# Altium schematic sheet INSGPS.SchDoc
size Legal
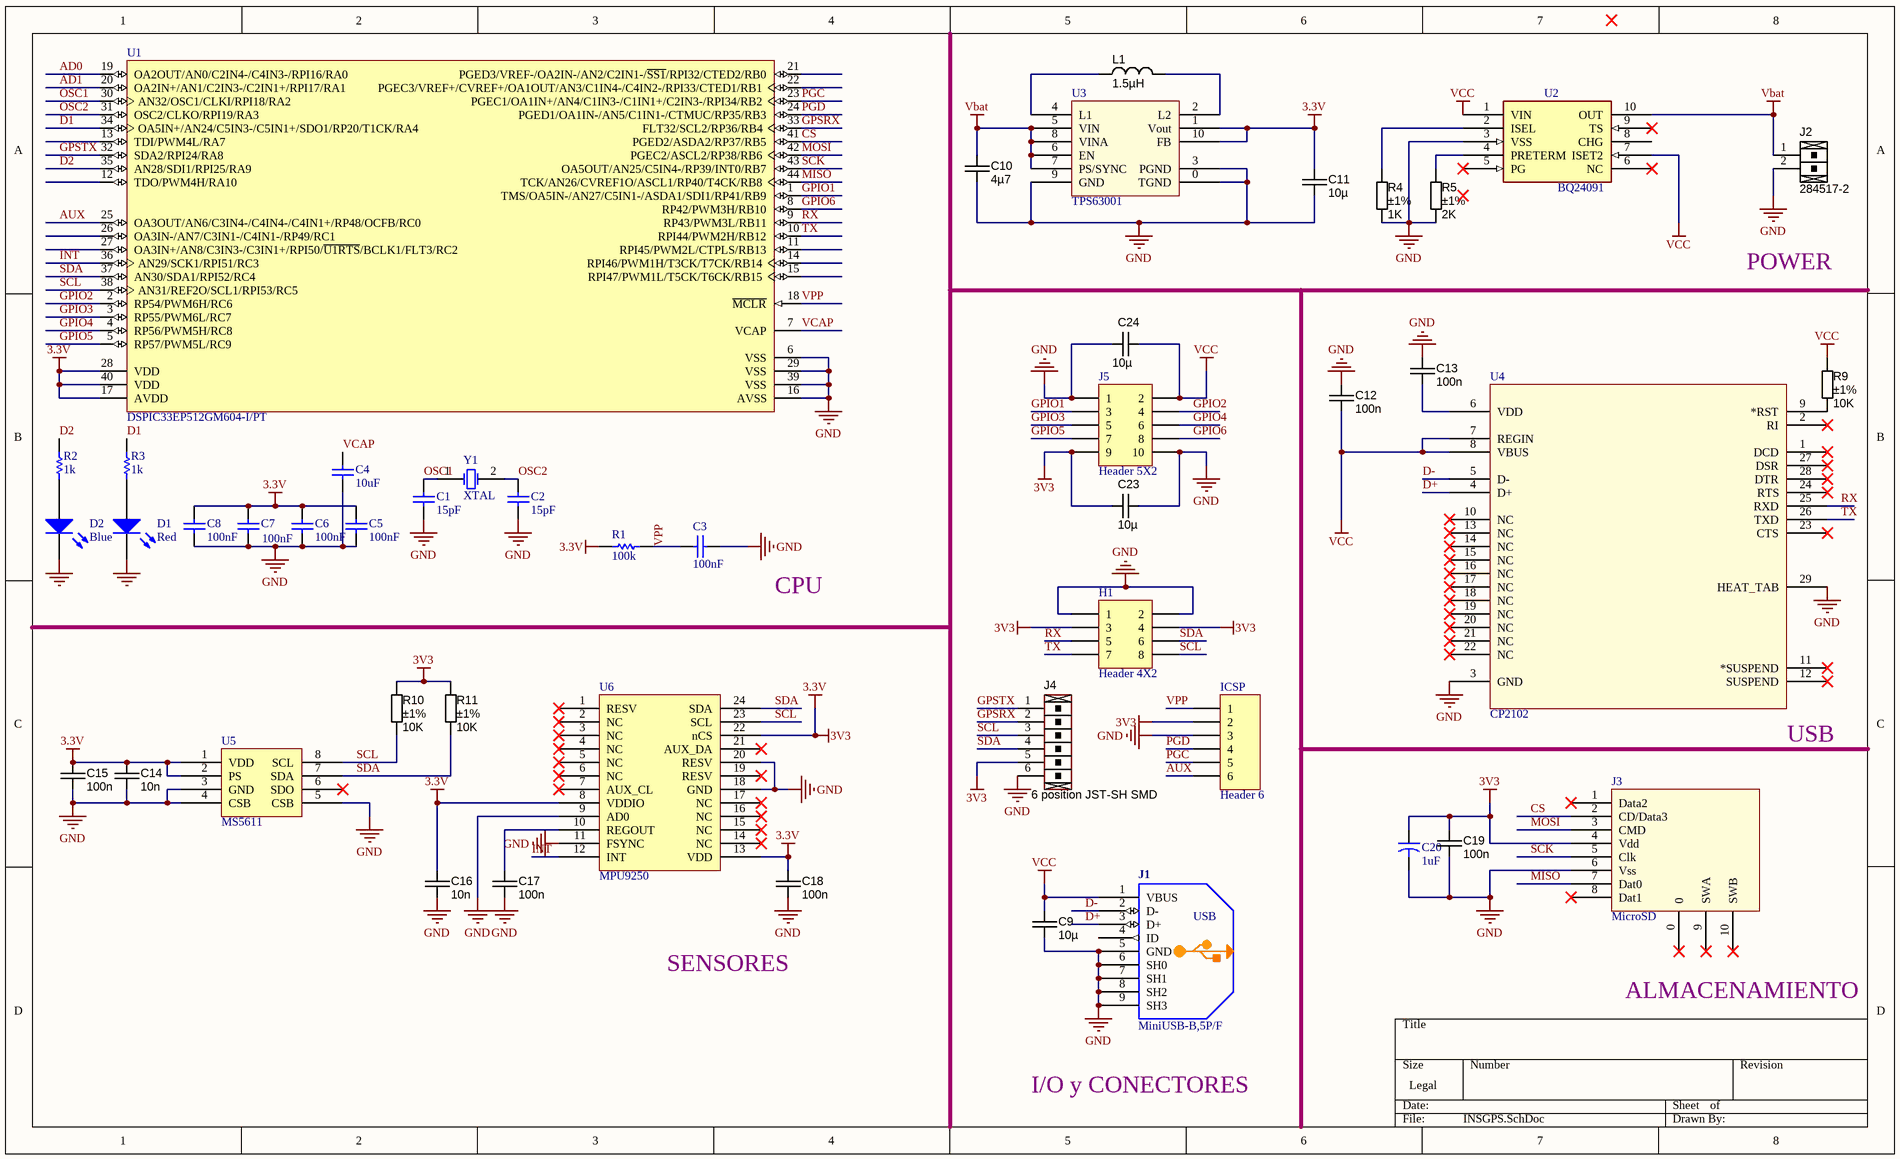
[diagram p0: INSGPS.SchDoc]

## Parts
C1  15pF  [C0805]
C2  15pF  [C0805]
C3  100nF  [C0805]
C4  10uF  [C0805]
C5  100nF  [C0805]
C6  100nF  [C0805]
C7  100nF  [C0805]
C8  100nF  [C0805]
C9  10µ  [CAPC3216X180N]
C10  4µ7  [CAPC2012X135N]
C11  10µ  [CAPC3216X180N]
C12  100n  [CAPC2012X135N]
C13  100n  [CAPC2012X135N]
C14  10n  [CAPC2012X135N]
C15  100n  [CAPC2012X135N]
C16  10n  [CAPC2012X135N]
C17  100n  [CAPC2012X135N]
C18  100n  [CAPC2012X135N]
C19  100n  [CAPC2012X135N]
C20  1uF  [CC3216-1206]
C23  10µ  [CAPC3216X180N]
C24  10µ  [CAPC3216X180N]
D1  Red  [0805 LED RED]
D2  Blue  [0805 LED RED]
H1  Header 4X2  [HDR2X4]
ICSP  Header 6  [HDR1X6]
J1  value MiniUSB-B,5P/F  [USB_MINIB_SMT]  (hidden comment: USB_MINIB_SMT)
J2  Manufacturer Part Number 1: 284517-2  [S2B-PH-K-S]  (hidden comment: ST 2 pins 1mm pitch)
J3  MicroSD  [SD CARD]
J4  6 position JST-SH SMD  [SM06B-SRSS-TB]
J5  Header 5X2  [HDR2X5]
L1  1.5µH  [IND_COILCRAFT_LPS3015]
R1  100k  [6-0805_M]
R2  1k  [6-0805_M]
R3  1k  [6-0805_M]
R4  Tolerance: ±1%  [RESC2012X70N]  (hidden comment: 1K)
R5  Tolerance: ±1%  [RESC2012X70N]  (hidden comment: 2K)
R9  Tolerance: ±1%  [RESC2012X70N]  (hidden comment: 10K)
R10  Tolerance: ±1%  [RESC2012X70N]  (hidden comment: 10K)
R11  Tolerance: ±1%  [RESC2012X70N]  (hidden comment: 10K)
U1  DSPIC33EP512GM604-I/PT  [TQFP-44]
U2  BQ24091  [10MSOP-PowerPAD]
U3  TPS63001  [TDFN-EP 10]
U4  CP2102  [QFN50P400X400X95-28N]
U5  MS5611  [MS5611]
U6  MPU9250  [QFN50P400X400X95-24N]
Y1  XTAL  [CRYSTAL_NX5032GA / NX5032GB]

## Nets
3.3V: C5.2 C6.1 C7.2 C8.2 C11.1 C14.1 C15.1 C16.1 C18.1 C19.1 C20.1 C23.1 H1.3 H1.4 ICSP.2 J3.4(Vdd) J4.5 J5.9 R1.2 R10.1 R11.1 U1.17(AVDD) U1.28(VDD) U1.40(VDD) U3.1(Vout) U3.10(FB) U5.1(VDD) U5.2(PS) U6.8(VDDIO) U6.13(VDD) U6.22(nCS)  [also labelled 3V3]
GND: C1.1 C2.1 C3.1 C4.1 C5.1 C6.2 C7.1 C8.1 C9.2 C10.2 C11.2 C12.2 C13.1 C14.2 C15.2 C16.2 C17.2 C18.2 C19.2 C20.2 C23.2 C24.1 D1.2(K) D2.2(K) H1.1 H1.2 ICSP.3 J1.5(GND) J1.6(SH0) J1.7(SH1) J1.8(SH2) J1.9(SH3) J2.2 J3.6(Vss) J4.6 J5.1 J5.10 R4.2 R5.2 U1.6(VSS) U1.16(AVSS) U1.29(VSS) U1.39(VSS) U2.3(VSS) U3.0(TGND) U3.3(PGND) U3.9(GND) U4.3(GND) U4.29(HEAT_TAB) U5.3(GND) U5.4(CSB) U5.5(CSB) U6.9(AD0) U6.11(FSYNC) U6.18(GND) U6.20(RESV)
Vbat: C10.1 J2.1 U2.10(OUT) U3.5(VIN) U3.6(EN) U3.7(PS/SYNC) U3.8(VINA)
VCC: C9.1 C12.1 C24.2 J1.1(VBUS) J5.2 R9.1 U2.1(VIN) U2.7(ISET2) U4.7(REGIN) U4.8(VBUS)
AD0: U1.19(OA2OUT/AN0/C2IN4-/C4IN3-/RPI16/RA0)
AD1: U1.20(OA2IN+/AN1/C2IN3-/C2IN1+/RPI17/RA1)
AUX: ICSP.6 U1.25(OA3OUT/AN6/C3IN4-/C4IN4-/C4IN1+/RP48/OCFB/RC0)
CS: J3.2(CD/Data3) U1.41(PGED2/ASDA2/RP37/RB5)
D1: R3.1 U1.34(OA5IN+/AN24/C5IN3-/C5IN1+/SDO1/RP20/T1CK/RA4)
D2: R2.1 U1.35(AN28/SDI1/RPI25/RA9)
D+: J1.3(D+) U4.4(D+)
D-: J1.2(D-) U4.5(D-)
GPIO1: J5.3 U1.1(TMS/OA5IN-/AN27/C5IN1-/ASDA1/SDI1/RP41/RB9)
GPIO2: J5.4 U1.2(RP54/PWM6H/RC6)
GPIO3: J5.5 U1.3(RP55/PWM6L/RC7)
GPIO4: J5.6 U1.4(RP56/PWM5H/RC8)
GPIO5: J5.7 U1.5(RP57/PWM5L/RC9)
GPIO6: J5.8 U1.8(RP42/PWM3H/RB10)
GPSRX: J4.2 U1.33(FLT32/SCL2/RP36/RB4)
GPSTX: J4.1 U1.32(SDA2/RPI24/RA8)
INT: U1.36(AN29/SCK1/RPI51/RC3) U6.12(INT)
MISO: J3.7(Dat0) U1.44(TCK/AN26/CVREF1O/ASCL1/RP40/T4CK/RB8)
MOSI: J3.3(CMD) U1.42(PGEC2/ASCL2/RP38/RB6)
OSC1: C1.2 U1.30(AN32/OSC1/CLKI/RPI18/RA2) Y1.1(OSC1)
OSC2: C2.2 U1.31(OSC2/CLKO/RPI19/RA3) Y1.2(OSC2)
PGC: ICSP.5 U1.23(PGEC1/OA1IN+/AN4/C1IN3-/C1IN1+/C2IN3-/RPI34/RB2)
PGD: ICSP.4 U1.24(PGED1/OA1IN-/AN5/C1IN1-/CTMUC/RP35/RB3)
RX: H1.5 U1.9(RP43/PWM3L/RB11) U4.25(RXD)
SCK: J3.5(Clk) U1.43(OA5OUT/AN25/C5IN4-/RP39/INT0/RB7)
SCL: H1.8 J4.3 R10.2 U1.38(AN31/REF2O/SCL1/RPI53/RC5) U5.8(SCL) U6.23(SCL)
SDA: H1.6 J4.4 R11.2 U1.37(AN30/SDA1/RPI52/RC4) U5.7(SDA) U6.24(SDA)
TX: H1.7 U1.10(RPI44/PWM2H/RB12) U4.26(TXD)
VCAP: C4.2 U1.7(VCAP)
VPP: C3.2 ICSP.1 R1.1 U1.18(~{MCLR})
NetC13_2: C13.2 U4.6(VDD)
NetC17_1: C17.1 U6.10(REGOUT)
NetD1_1: D1.1(A) R3.2
NetD2_1: D2.1(A) R2.2
NetL1_1: L1.1 U3.4(L1)
NetL1_2: L1.2 U3.2(L2)
NetR4_1: R4.1 U2.2(ISEL)
NetR5_1: R5.1 U2.4(PRETERM)
NetR9_2: R9.2 U4.9(*RST)

Not connected (* = marked no-connect by the designer): J1 4(ID); J3 0* 1(Data2)* 8(Dat1)* 9(SWA)* 10(SWB)*; U1 11(RPI45/PWM2L/CTPLS/RB13) 12(TDO/PWM4H/RA10) 13(TDI/PWM4L/RA7) 14(RPI46/PWM1H/T3CK/T7CK/RB14) 15(RPI47/PWM1L/T5CK/T6CK/RB15) 21(PGED3/VREF-/OA2IN-/AN2/C2IN1-/~{SS1}/RPI32/CTED2/RB0) 22(PGEC3/VREF+/CVREF+/OA1OUT/AN3/C1IN4-/C4IN2-/RPI33/CTED1/RB1) 26(OA3IN-/AN7/C3IN1-/C4IN1-/RP49/RC1) 27(OA3IN+/AN8/C3IN3-/C3IN1+/RPI50/~{U1RTS}/BCLK1/FLT3/RC2); U2 5(PG)* 6(NC)* 8(CHG) 9(TS)*; U4 1(DCD)* 2(RI)* 10(NC)* 11(*SUSPEND)* 12(SUSPEND)* 13(NC)* 14(NC)* 15(NC)* 16(NC)* 17(NC)* 18(NC)* 19(NC)* 20(NC)* 21(NC)* 22(NC)* 23(CTS)* 24(RTS)* 27(DSR)* 28(DTR)*; U5 6(SDO)*; U6 1(RESV)* 2(NC)* 3(NC)* 4(NC)* 5(NC)* 6(NC)* 7(AUX_CL)* 14(NC)* 15(NC)* 16(NC)* 17(NC)* 19(RESV)* 21(AUX_DA)*

## Notes on the sheet
- POWER
- CPU
- (near U4) USB
- SENSORES
- ALMACENAMIENTO
- I/O y CONECTORES
- (in symbol USB_MINIB_SMT) USB

## Library data of the parts
C1-C8 = Cap: Capacitor; Published: 8-Jun-2000; LatestRevisionDate: 17-Jul-2002; LatestRevisionNote: Re-released for DXP Platform.; PackageReference: RAD-0.3; Publisher: Altium Limited; PackageDescription: Radial Cap, Thru-Hole; 2 Leads; 0.3 in Pin Spacing
  C1 C2: Value: 15pF
  C3 C5-C8: Value: 100nF
  C4: Value: 10uF
C9 C11 C23 C24 = CAPC_10u_1206_10V: Capacitor SMD Cer 10uF 10% 10V X5R 1206; Manufacturer 1: KEMET; Manufacturer Part Number 1: C1206C106K8PACTU; Ratings: 10V; X5R; Material: ceramic; SCDType: undef; Package / Case: 1206 (3216 metric); Tolerance: ±10%; Supplier 1: Digi-Key; Supplier Part Number 1: C1206C106K8PACTU-ND; Value: 10µ
C10 = CAPC_4u7_0805: Capacitor SMD Cer 4.7uF 10% 16V X5R 0805; Manufacturer 1: Taiyo Yuden; Manufacturer Part Number 1: EMK212BJ475KG-T; Ratings: 16V; X5R; Material: ceramic; SCDType: spec; Package / Case: 0805 (2012 Metric); Tolerance: ±10%; Supplier 1: Digi-Key; Supplier Part Number 1: 587-1294-1-ND; Operating Temperature: -55°C ~ 85°C; Size / Dimension: 0.079" L x 0.049" W (2.00mm x 1.25mm); Thickness (Max): 0.053" (1.35mm); ComponentLink1URL: http://www.yuden.co.jp/productdata/catalog/en/mlcc01_e.pdf; ComponentLink1Description: http://www.yuden.co.jp/productdata/catalog/en/mlcc01_e.pdf; Supplier 2: Digi-Key; Supplier Part Number 2: 1276-1065-1-ND; Manufacturer 2: Samsung Electro-Mechanics America, Inc; Manufacturer Part Number 2: CL21A475KOFNNNE; RoHS 2: RoHS Compliant; ComponentLink2URL: http://www.samsungsem.com/servlet/FileDownload?type=spec&file=CL21A475KOFNNNE.pdf; ComponentLink2Description: http://www.samsungsem.com/servlet/FileDownload?type=spec&file=CL21A475KOFNNNE.pdf; Supplier 3: Digi-Key; Supplier Part Number 3: 399-8101-1-ND; Manufacturer 3: Kemet; Manufacturer Part Number 3: C0805C475K4PACTU; RoHS 3: RoHS Compliant; ComponentLink3URL: http://capacitoredge.kemet.com/capedge2/DataSheet?pn=C0805C475K4PACTU; ComponentLink3Description: http://capacitoredge.kemet.com/capedge2/DataSheet?pn=C0805C475K4PACTU; Supplier 4: Digi-Key; Supplier Part Number 4: 490-7215-1-ND; Manufacturer 4: Murata Electronics North America; Manufacturer Part Number 4: GRM21BR61C475MA88L; RoHS 4: RoHS Compliant; ComponentLink4URL: http://psearch.murata.com/capacitor/product/GRM21BR61C475MA88#.pdf; ComponentLink4Description: http://psearch.murata.com/capacitor/product/GRM21BR61C475MA88#.pdf; Supplier 5: Digi-Key; Supplier Part Number 5: 445-7640-1-ND; Manufacturer 5: TDK Corporation; Manufacturer Part Number 5: C2012X5R1C475K125AC; RoHS 5: RoHS Compliant; ComponentLink5URL: http://product.tdk.com/capacitor/mlcc/en/documents/mlcc_commercial_general_en.pdf; ComponentLink5Description: http://product.tdk.com/capacitor/mlcc/en/documents/mlcc_commercial_general_en.pdf; RoHS 1: RoHS Compliant; Value: 4µ7
C12-C19 = CAPC_100n_0805_X7R_100V_10%: Capacitor SMD Cer 100nF 10% 100V X7R 0805; Manufacturer 1: TDK Corporation; Manufacturer Part Number 1: C2012X7R2A104K; Ratings: 100V; X7R; Material: ceramic; SCDType: undef; Package / Case: 0805; Tolerance: ±10%; Supplier 1: Digi-Key; Supplier Part Number 1: 445-1418-1-ND
  C12 C13 C15 C17-C19: Value: 100n
  C14 C16: Value: 10n
C20 = Cap2: Capacitor Tantalium 1206; Published: 23-Sep-2002; PackageReference: CAPR5-4X5; Publisher: Altium Limited; PackageDescription: Capacitor; 2 Leads; Value: 1uF
D1 D2 = LED3: Typical BLUE SiC LED; Published: 8-Jun-2000; LatestRevisionDate: 17-Dec-2003; LatestRevisionNote: PCB Footprint replaced.; DatasheetDocument: 16-Apr-2002; PackageDocument: 16-Apr-2002; PackageReference: 3.5X2.8X1.9; Publisher: Altium Limited
H1 = Header 4X2: Header, 4-Pin, Dual row; LatestRevisionDate: 17-Jul-2002; LatestRevisionNote: Re-released for DXP Platform.; Publisher: Altium Limited
ICSP = Header 6: Header, 6-Pin; LatestRevisionDate: 17-Jul-2002; LatestRevisionNote: Re-released for DXP Platform.; Publisher: Altium Limited
J1 = USB_MINIB_SMT: MiniUSB-B,5P/F,7.6¡Á9¡Á4,SMD,RoHS; Text Field1: 100; Text Field2: 80; ÎïÁÏ´úÂë: 1.10.05.0024; Ãû³Æ: USB²å×ù; ÌùÆ¬ºÍÖ±²å: SMT; RoHS: RoHS; ÐÍºÅ: MiniUSB-B,5P/F,7.6¡Á9¡Á4,SMD; ComponentLink1Description: ErpDataInfo; ComponentLink1URL: http://erp.zlgmcu.com/ErpExt/ErpData/ListMateriel.aspx?pkey=1.10.05.0024
J2 = 2P_TERM_BLOCK_HEADER: Terminal Block THT 2-position header 3.81mm pitch; Manufacturer 1: TE Connectivity; Pitch: 0.150" (3.81mm); Voltage: 300V; Positions Per Level: 2; SCDType: undef; Mating Connector: 284507-2; Category: Connectors; Terminal Block Type: Header, Male Pins, Right-angle, Shrouded (4 Side); Mounting Type: Through Hole; Supplier 1: Digi-Key; Supplier Part Number 1: A98410-ND; Package / Case: Header; 3.81mm pitch
J4 = 6P_TERM BLOCK HEADER: JST-SH, 6-Position connector, 1mm pitch; Manufacturer 1: Tyco Electronics; Manufacturer Part Number 1: 284517-6; Pitch: 0.150" (3.81mm); Voltage: 300V; Mating Connector: 284507-6; Positions Per Level: 6; SCDType: undef; Category: Connectors; Mounting Type: Through Hole; Terminal Block Type: Header, Male Pins, Shrouded (4 Side); Package / Case: Side Entry; 3.81mm pitch; Value: 6 position JST-SH SMD; Supplier 1: Digi-Key; Supplier Part Number 1: A98203-ND
J5 = Header 5X2: Header, 5-Pin, Dual row; LatestRevisionDate: 17-Jul-2002; LatestRevisionNote: Re-released for DXP Platform.; Publisher: Altium Limited
L1 = INDC_10u_LowRDC: Inductor SMD Low DCR 10 µH 900mA 20% 1210; Manufacturer 1: Taiyo Yuden; Manufacturer Part Number 1: CBC3225T100MR; Ratings: 900 mA; 133 mOhm; DC Resistance (DCR): 172.9 mOhm Max; Frequency - Self Resonant: 23MHz; Frequency - Test: 100kHz; SCDType: spec; Tolerance: ±20%; Supplier 1: Digi-Key; Supplier Part Number 1: 587-1625-1-ND; Current: 900mA; Current - Saturation: 900mA; Current - Temperature Rise: 900mA; Applications: Power Supplies; Package / Case: 1210 (3225 Metric); Operating Temperature: -40°C ~ 105°C; ComponentLink1URL: http://www.yuden.co.jp/ut/product/pdf/wound02_e.pdf; ComponentLink1Description: http://www.yuden.co.jp/ut/product/pdf/wound02_e.pdf; Value: 1.5µH
R1-R3 = Res1: Chip Resistor 0805; Published: 8-Jun-2000; LatestRevisionDate: 17-Jul-2002; LatestRevisionNote: Re-released for DXP Platform.; PackageReference: AXIAL-0.3; Publisher: Altium Limited
  R1: Value: 100k
  R2 R3: Value: 1k
R4 R5 R9-R11 = RES_1K_0805_1%: Resistor SMD chip 1k Ohm 0.125W 1% 0805; Manufacturer 1: Vishay/Dale; Manufacturer Part Number 1: CRCW08051K00FKEA; Ratings: 1/8W; SCDType: spec; Supplier 1: Digi-Key; Supplier Part Number 1: 541-1.00KCCT-ND; Package / Case: 0805 (2012 metric)
  R4: Value: 1K
  R5: Value: 2K
  R9-R11: Value: 10K
U1 = DSPIC33EP512GM604-I/PT: 16-Bit Digital Signal Controllers with High-Speed PWM, Op Amps and Advanced Analog Features, 70 MIPS, 35 I/O, Industrial Temperature, 44-Pin TQFP (PT44), Tray; Manufacturer: Microchip; VCC Range: 3.0 to 3.6 V; DatasheetVersion: Rev. C; PackageVersion: C04-076B, 12/2012; PackageReference: TQFP-PT44; PackageDescription: 44-Lead Plastic Thin Quad Flatpack, 10 x 10 mm Body, 0.8 mm Pitch; Supplier 1: Digi-Key; Supplier Part Number 1: DSPIC33EP512GM604-I/PT-ND; Supplier 2: Farnell; Supplier Part Number 2: 2353895; Supplier 3: Newark; Supplier Part Number 3: 66W6866; Supplier 4: Mouser; Supplier Part Number 4: 579-512GM604-I/PT; Packing: Tray; Mounting Technology: Surface Mount; PartNumber: DSPIC33EP512GM604-I/PT; ComponentLink1Description: Manufacturer URL; ComponentLink1URL: http://www.microchip.com/; ComponentLink2Description: Datasheet; ComponentLink2URL: http://ww1.microchip.com/downloads/en/DeviceDoc/70000689c.pdf; ComponentLink3Description: Package Specification; ComponentLink3URL: http://www.microchip.com/stellent/groups/techpub_sg/documents/packagingspec/en012702.pdf
U2 = BQ2409X
U3 = TPS6303X
U5 = MS5611: Sensor digital de presion barometrica absoluta con interfaz I2C
U6 = MPU9250: The MPU-9250 is the world’s first integrated 9-axis MotionTracking device that combines a 3-axis   gyroscope, 3-axis accelerometer, and a Digital Motion Processor™ (DMP) all in a small 4x4x0.9mm   package.
Y1 = XTAL: Crystal Oscillator; Value: 12MHz; Published: 8-Jun-2000; LatestRevisionDate: 17-Jul-2002; LatestRevisionNote: Re-released for DXP Platform.; PackageReference: R38; Publisher: Altium Limited